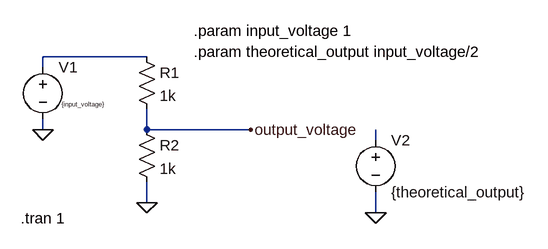
[diagram p0: schematic Draft4.asc]
Draft4.asc, the LTspice schematic file:
Version 4
SHEET 1 880 680
WIRE 224 128 64 128
WIRE 64 144 64 128
WIRE 64 240 64 224
WIRE 224 240 224 208
WIRE 384 240 224 240
WIRE 576 256 576 240
WIRE 224 352 224 320
WIRE 576 368 576 336
FLAG 64 240 0
FLAG 224 352 0
FLAG 384 240 output_voltage
FLAG 576 368 0
SYMBOL voltage 64 128 R0
WINDOW 3 29 73 Left 0
WINDOW 123 0 0 Left 0
WINDOW 39 0 0 Left 0
SYMATTR InstName V1
SYMATTR Value {input_voltage}
SYMBOL res 208 112 R0
SYMATTR InstName R1
SYMATTR Value 1k
SYMBOL res 208 224 R0
SYMATTR InstName R2
SYMATTR Value 1k
SYMBOL voltage 576 240 R0
WINDOW 123 0 0 Left 0
WINDOW 39 0 0 Left 0
SYMATTR InstName V2
SYMATTR Value {theoretical_output}
TEXT 296 88 Left 2 !.param input_voltage 1
TEXT 296 120 Left 2 !.param theoretical_output input_voltage/2
TEXT 30 376 Left 2 !.tran 1

The netlist it stands for:
* Draft4.asc
V1 N001 0 {input_voltage}
R1 N001 output_voltage 1k
R2 output_voltage 0 1k
V2 N002 0 {theoretical_output}
.param input_voltage 1
.param theoretical_output input_voltage/2
.tran 1
.backanno
.end